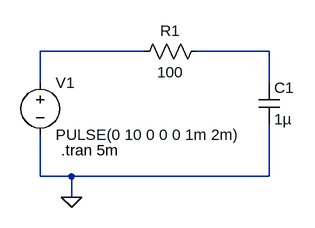
[diagram p0: schematic 2ndRC.asc]
2ndRC.asc, the LTspice schematic file:
Version 4
SHEET 1 880 680
WIRE 160 64 0 64
WIRE 352 64 240 64
WIRE 0 112 0 64
WIRE 352 112 352 64
WIRE 0 256 0 192
WIRE 48 256 0 256
WIRE 352 256 352 176
WIRE 352 256 48 256
WIRE 48 288 48 256
FLAG 48 288 0
SYMBOL voltage 0 96 R0
WINDOW 123 0 0 Left 0
WINDOW 39 0 0 Left 0
SYMATTR InstName V1
SYMATTR Value PULSE(0 10 0 0 0 1m 2m)
SYMBOL res 256 48 R90
WINDOW 0 0 56 VBottom 2
WINDOW 3 32 56 VTop 2
SYMATTR InstName R1
SYMATTR Value 100
SYMBOL cap 336 112 R0
SYMATTR InstName C1
SYMATTR Value 1µ
TEXT 32 216 Left 2 !.tran 5m

The netlist it stands for:
* 2ndRC.asc
V1 N001 0 PULSE(0 10 0 0 0 1m 2m)
R1 N002 N001 100
C1 N002 0 1µ
.tran 5m
.backanno
.end